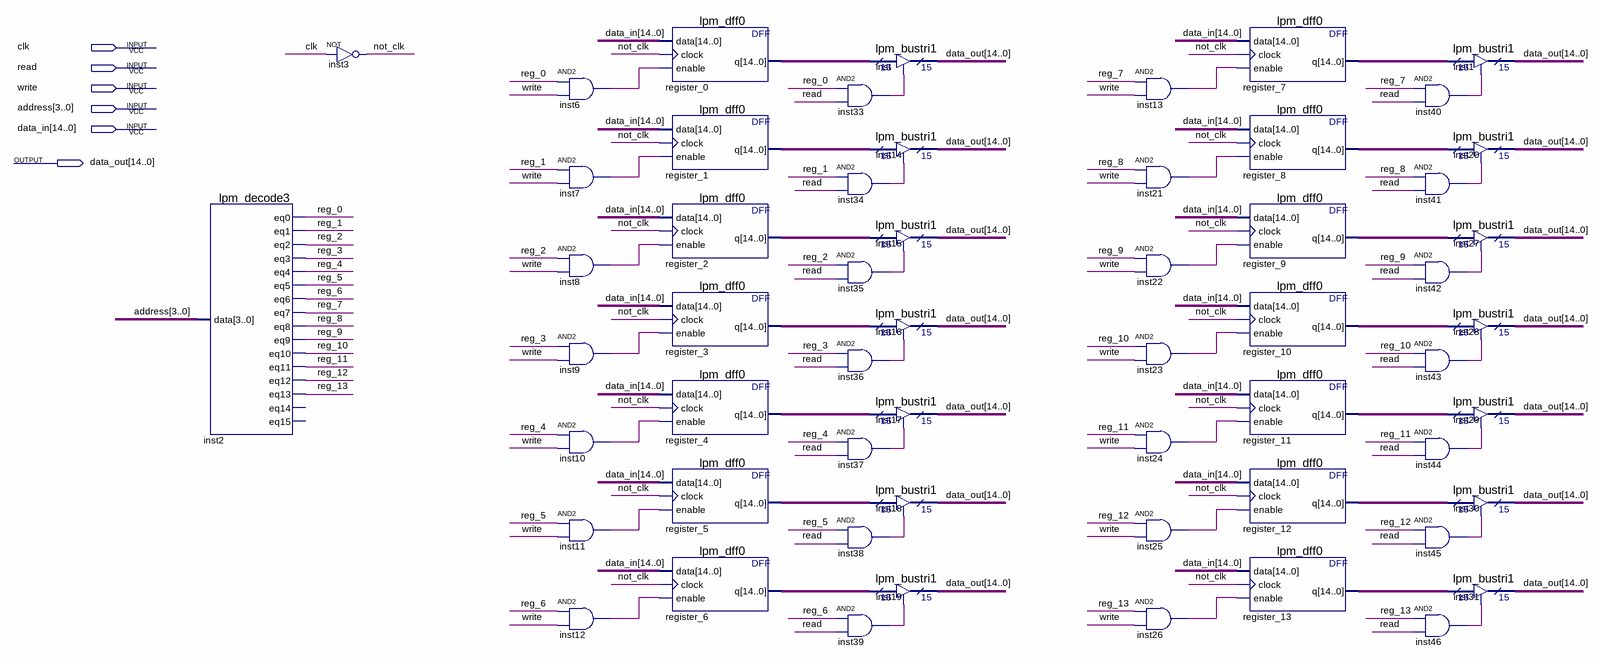
[diagram p0: schematic sheet]
// Quartus schematic registers.bdf as structural Verilog: 58 symbols, 6 pins
module registers (
  input  clk,
  input  read,
  input  write,
  input  [3:0] address,
  input  [14:0] data_in,
  output [14:0] data_out
);

  wire inst6_out, inst7_out, inst8_out, inst9_out, inst10_out, inst11_out, inst12_out, inst13_out,
       inst21_out, inst22_out, inst23_out, inst24_out, inst25_out, inst26_out, inst33_out, inst34_out,
       inst35_out, inst36_out, inst37_out, inst38_out, inst39_out, inst40_out, inst41_out, inst42_out,
       inst43_out, inst44_out, inst45_out, inst46_out, not_clk, reg_0, reg_1, reg_2, reg_3, reg_4, reg_5,
       reg_6, reg_7, reg_8, reg_9, reg_10, reg_11, reg_12, reg_13;
  wire [14:0] register_0_q, register_1_q, register_2_q, register_3_q, register_4_q, register_5_q,
       register_6_q, register_7_q, register_8_q, register_9_q, register_10_q, register_11_q, register_12_q,
       register_13_q;

  lpm_decode3 inst2 (
    .data(address), .eq0(reg_0), .eq1(reg_1), .eq2(reg_2), .eq3(reg_3), .eq4(reg_4), .eq5(reg_5),
    .eq6(reg_6), .eq7(reg_7), .eq8(reg_8), .eq9(reg_9), .eq10(reg_10), .eq11(reg_11), .eq12(reg_12),
    .eq13(reg_13));  // open: eq14, eq15
  not inst3 (not_clk, clk);
  and inst6 (inst6_out, reg_0, write);
  and inst7 (inst7_out, reg_1, write);
  and inst8 (inst8_out, reg_2, write);
  and inst9 (inst9_out, reg_3, write);
  and inst10 (inst10_out, reg_4, write);
  and inst11 (inst11_out, reg_5, write);
  and inst12 (inst12_out, reg_6, write);
  lpm_dff0 register_0 (.data(data_in), .clock(not_clk), .enable(inst6_out), .q(register_0_q));
  lpm_dff0 register_1 (.data(data_in), .clock(not_clk), .enable(inst7_out), .q(register_1_q));
  lpm_dff0 register_2 (.data(data_in), .clock(not_clk), .enable(inst8_out), .q(register_2_q));
  lpm_dff0 register_3 (.data(data_in), .clock(not_clk), .enable(inst9_out), .q(register_3_q));
  lpm_dff0 register_4 (.data(data_in), .clock(not_clk), .enable(inst10_out), .q(register_4_q));
  lpm_dff0 register_5 (.data(data_in), .clock(not_clk), .enable(inst11_out), .q(register_5_q));
  lpm_dff0 register_6 (.data(data_in), .clock(not_clk), .enable(inst12_out), .q(register_6_q));
  and inst33 (inst33_out, reg_0, read);
  and inst34 (inst34_out, reg_1, read);
  and inst35 (inst35_out, reg_2, read);
  and inst36 (inst36_out, reg_3, read);
  and inst37 (inst37_out, reg_4, read);
  and inst38 (inst38_out, reg_5, read);
  and inst39 (inst39_out, reg_6, read);
  lpm_bustri1 inst (.enabledt(inst33_out), .data(register_0_q), .tridata(data_out));
  lpm_bustri1 inst14 (.enabledt(inst34_out), .data(register_1_q), .tridata(data_out));
  lpm_bustri1 inst15 (.enabledt(inst35_out), .data(register_2_q), .tridata(data_out));
  lpm_bustri1 inst16 (.enabledt(inst36_out), .data(register_3_q), .tridata(data_out));
  lpm_bustri1 inst17 (.enabledt(inst37_out), .data(register_4_q), .tridata(data_out));
  lpm_bustri1 inst18 (.enabledt(inst38_out), .data(register_5_q), .tridata(data_out));
  lpm_bustri1 inst19 (.enabledt(inst39_out), .data(register_6_q), .tridata(data_out));
  and inst13 (inst13_out, reg_7, write);
  and inst21 (inst21_out, reg_8, write);
  and inst22 (inst22_out, reg_9, write);
  and inst23 (inst23_out, reg_10, write);
  and inst24 (inst24_out, reg_11, write);
  and inst25 (inst25_out, reg_12, write);
  and inst26 (inst26_out, reg_13, write);
  lpm_dff0 register_7 (.data(data_in), .clock(not_clk), .enable(inst13_out), .q(register_7_q));
  lpm_dff0 register_8 (.data(data_in), .clock(not_clk), .enable(inst21_out), .q(register_8_q));
  lpm_dff0 register_9 (.data(data_in), .clock(not_clk), .enable(inst22_out), .q(register_9_q));
  lpm_dff0 register_10 (.data(data_in), .clock(not_clk), .enable(inst23_out), .q(register_10_q));
  lpm_dff0 register_11 (.data(data_in), .clock(not_clk), .enable(inst24_out), .q(register_11_q));
  lpm_dff0 register_12 (.data(data_in), .clock(not_clk), .enable(inst25_out), .q(register_12_q));
  lpm_dff0 register_13 (.data(data_in), .clock(not_clk), .enable(inst26_out), .q(register_13_q));
  lpm_bustri1 inst1 (.enabledt(inst40_out), .data(register_7_q), .tridata(data_out));
  and inst40 (inst40_out, reg_7, read);
  lpm_bustri1 inst20 (.enabledt(inst41_out), .data(register_8_q), .tridata(data_out));
  and inst41 (inst41_out, reg_8, read);
  lpm_bustri1 inst27 (.enabledt(inst42_out), .data(register_9_q), .tridata(data_out));
  and inst42 (inst42_out, reg_9, read);
  lpm_bustri1 inst28 (.enabledt(inst43_out), .data(register_10_q), .tridata(data_out));
  and inst43 (inst43_out, reg_10, read);
  lpm_bustri1 inst29 (.enabledt(inst44_out), .data(register_11_q), .tridata(data_out));
  and inst44 (inst44_out, reg_11, read);
  lpm_bustri1 inst30 (.enabledt(inst45_out), .data(register_12_q), .tridata(data_out));
  and inst45 (inst45_out, reg_12, read);
  lpm_bustri1 inst31 (.enabledt(inst46_out), .data(register_13_q), .tridata(data_out));
  and inst46 (inst46_out, reg_13, read);
endmodule
